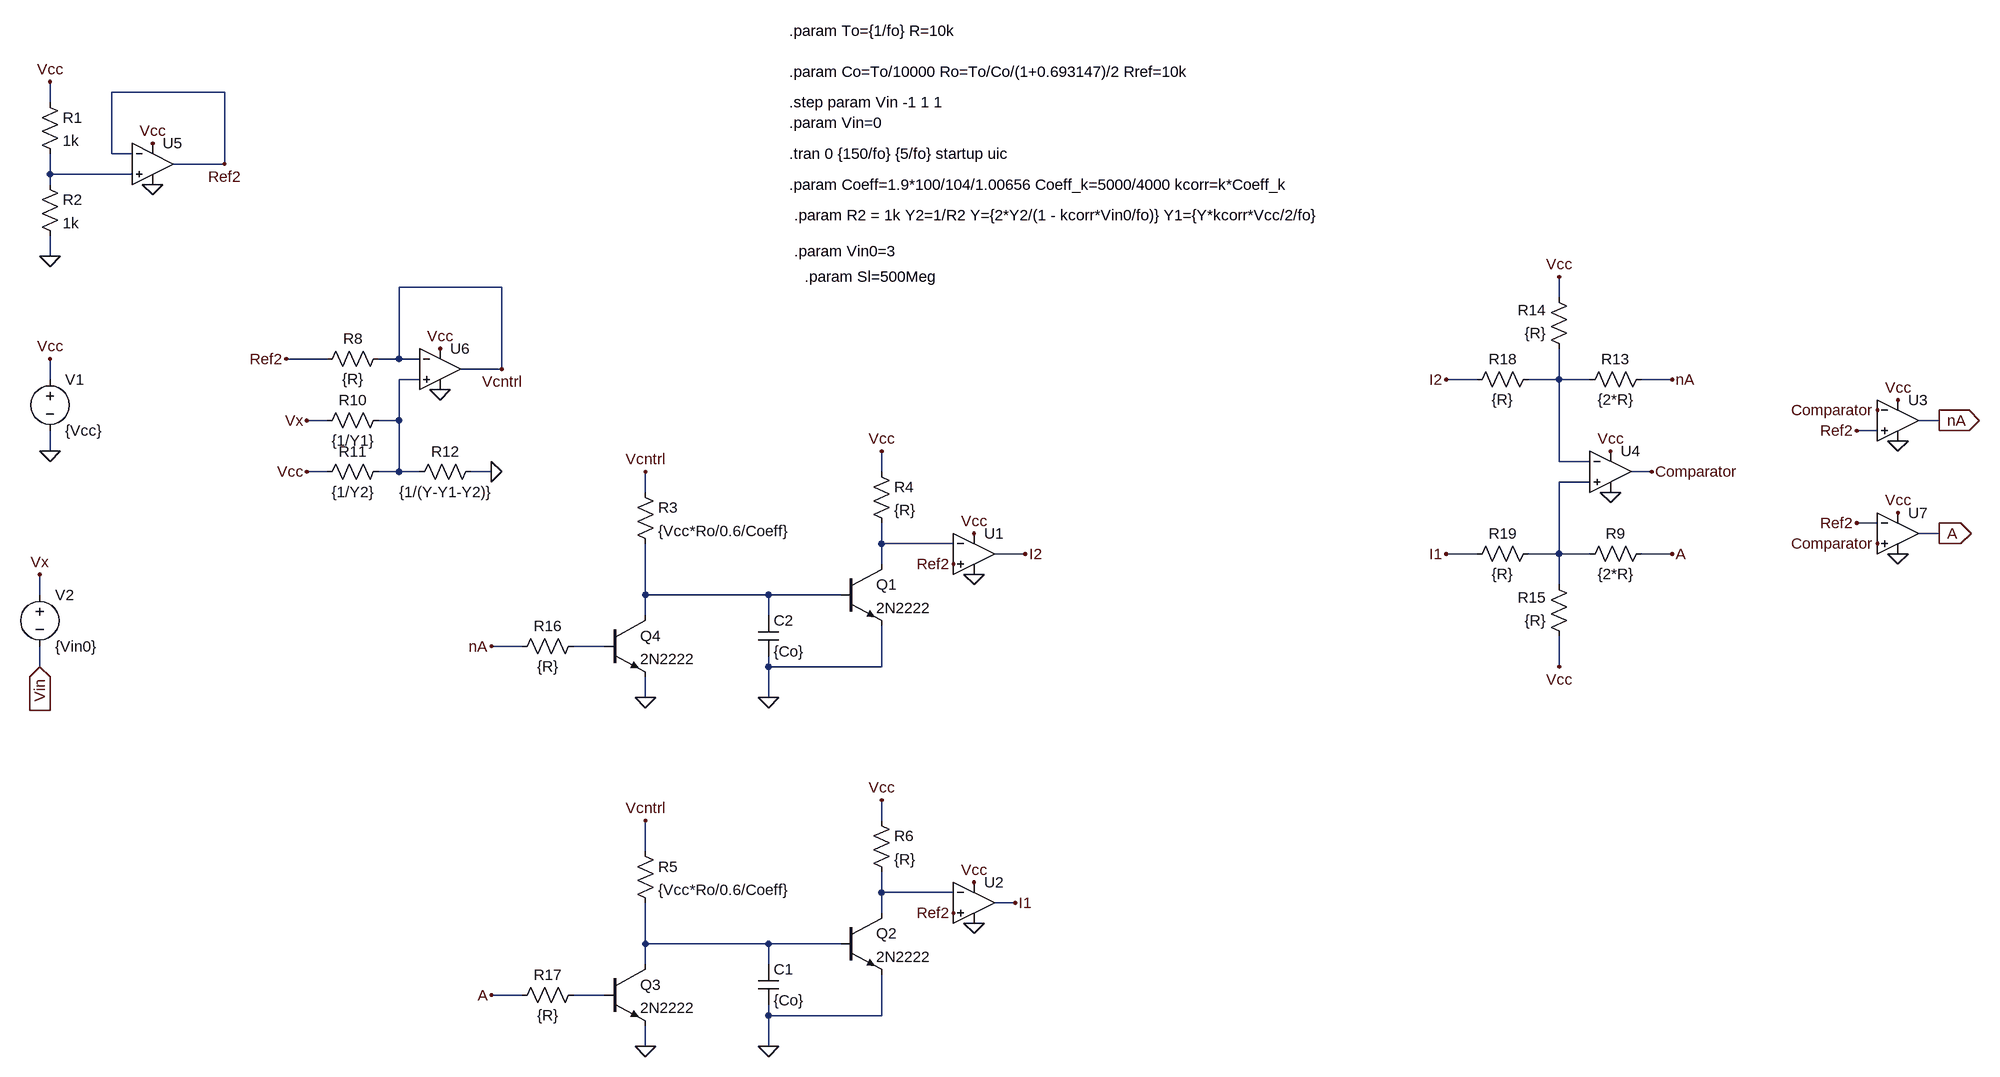
[diagram p0: schematic VCO_comp.asc]
VCO_comp.asc, the LTspice schematic file:
Version 4
SHEET 1 2680 1780
WIRE -80 -96 -256 -96
WIRE -352 -80 -352 -112
WIRE -256 0 -256 -96
WIRE -224 0 -256 0
WIRE -80 16 -80 -96
WIRE -80 16 -160 16
WIRE -352 32 -352 0
WIRE -224 32 -352 32
WIRE -352 48 -352 32
WIRE -352 160 -352 128
WIRE 352 208 192 208
WIRE 2000 224 2000 192
WIRE 80 320 16 320
WIRE 192 320 192 208
WIRE 192 320 160 320
WIRE 224 320 192 320
WIRE 352 336 352 208
WIRE 352 336 288 336
WIRE -352 352 -352 320
WIRE 224 352 192 352
WIRE 1872 352 1824 352
WIRE 2000 352 2000 304
WIRE 2000 352 1952 352
WIRE 2048 352 2000 352
WIRE 2176 352 2128 352
WIRE 80 416 48 416
WIRE 192 416 192 352
WIRE 192 416 160 416
WIRE 2592 416 2560 416
WIRE 2496 432 2464 432
WIRE -352 464 -352 432
WIRE 2000 480 2000 352
WIRE 2048 480 2000 480
WIRE 80 496 48 496
WIRE 192 496 192 416
WIRE 192 496 160 496
WIRE 224 496 192 496
WIRE 336 496 304 496
WIRE 944 496 944 464
WIRE 2144 496 2112 496
WIRE 2048 512 2000 512
WIRE 576 528 576 496
WIRE 2496 576 2464 576
WIRE 2592 592 2560 592
WIRE 944 608 944 576
WIRE 1056 608 944 608
WIRE 1168 624 1120 624
WIRE 1872 624 1824 624
WIRE 2000 624 2000 512
WIRE 2000 624 1952 624
WIRE 2048 624 2000 624
WIRE 2176 624 2128 624
WIRE 944 640 944 608
WIRE 2000 672 2000 624
WIRE -368 688 -368 656
WIRE 576 688 576 608
WIRE 768 688 576 688
WIRE 880 688 768 688
WIRE 576 720 576 688
WIRE 768 720 768 688
WIRE 384 768 336 768
WIRE 512 768 464 768
WIRE -368 800 -368 768
WIRE 768 800 768 784
WIRE 944 800 944 736
WIRE 944 800 768 800
WIRE 2000 800 2000 752
WIRE 576 848 576 816
WIRE 768 848 768 800
WIRE 944 1040 944 1008
WIRE 576 1088 576 1040
WIRE 944 1152 944 1120
WIRE 1056 1152 944 1152
WIRE 1152 1168 1120 1168
WIRE 944 1184 944 1152
WIRE 576 1232 576 1168
WIRE 768 1232 576 1232
WIRE 880 1232 768 1232
WIRE 576 1264 576 1232
WIRE 768 1264 768 1232
WIRE 384 1312 336 1312
WIRE 512 1312 464 1312
WIRE 768 1344 768 1328
WIRE 944 1344 944 1280
WIRE 944 1344 768 1344
WIRE 576 1392 576 1360
WIRE 768 1392 768 1344
FLAG -352 464 0
FLAG -352 320 Vcc
FLAG -352 160 0
FLAG -352 -112 Vcc
FLAG -80 16 Ref2
FLAG 2464 432 Ref2
FLAG 2080 464 Vcc
FLAG 2528 384 Vcc
FLAG 2080 528 0
FLAG 2528 448 0
FLAG 2592 592 A
IOPIN 2592 592 Out
FLAG 2592 416 nA
IOPIN 2592 416 Out
FLAG 2000 192 Vcc
FLAG 2000 800 Vcc
FLAG 1824 624 I1
FLAG 1824 352 I2
FLAG -368 656 Vx
FLAG -192 48 0
FLAG -192 -16 Vcc
FLAG 576 848 0
FLAG 768 848 0
FLAG 944 464 Vcc
FLAG 576 1392 0
FLAG 768 1392 0
FLAG 944 1008 Vcc
FLAG 1168 624 I2
FLAG 1152 1168 I1
FLAG 336 1312 A
FLAG 336 768 nA
FLAG 1088 656 0
FLAG 1088 592 Vcc
FLAG 1056 640 Ref2
FLAG 1088 1200 0
FLAG 1088 1136 Vcc
FLAG 1056 1184 Ref2
FLAG 16 320 Ref2
FLAG 256 304 Vcc
FLAG 256 368 0
FLAG 48 496 Vcc
FLAG 336 496 0
FLAG 48 416 Vx
FLAG 352 336 Vcntrl
FLAG 576 496 Vcntrl
FLAG 576 1040 Vcntrl
FLAG 2464 576 Ref2
FLAG 2528 560 Vcc
FLAG 2528 624 0
FLAG 2176 624 A
FLAG 2176 352 nA
FLAG 2144 496 Comparator
FLAG 2496 400 Comparator
FLAG 2496 608 Comparator
FLAG -368 800 Vin
IOPIN -368 800 In
SYMBOL voltage -352 336 R0
WINDOW 123 0 0 Left 0
WINDOW 39 0 0 Left 0
SYMATTR InstName V1
SYMATTR Value {Vcc}
SYMBOL res -368 -96 R0
SYMATTR InstName R1
SYMATTR Value 1k
SYMBOL res -368 32 R0
SYMATTR InstName R2
SYMATTR Value 1k
SYMBOL OpAmps\\UniversalOpAmp2 2528 416 R0
SYMATTR InstName U3
SYMATTR Value2 Avol=1Meg GBW=10Meg Slew={Sl}
SYMBOL OpAmps\\UniversalOpAmp2 2080 496 R0
SYMATTR InstName U4
SYMATTR Value2 Avol=1Meg GBW=10Meg Slew={Sl}
SYMBOL res 2144 608 R90
WINDOW 0 0 56 VBottom 2
WINDOW 3 32 56 VTop 2
SYMATTR InstName R9
SYMATTR Value {2*R}
SYMBOL res 2144 336 R90
WINDOW 0 0 56 VBottom 2
WINDOW 3 32 56 VTop 2
SYMATTR InstName R13
SYMATTR Value {2*R}
SYMBOL res 2016 320 R180
WINDOW 0 36 76 Left 2
WINDOW 3 36 40 Left 2
SYMATTR InstName R14
SYMATTR Value {R}
SYMBOL res 2016 768 R180
WINDOW 0 36 76 Left 2
WINDOW 3 36 40 Left 2
SYMATTR InstName R15
SYMATTR Value {R}
SYMBOL voltage -368 672 R0
WINDOW 123 0 0 Left 0
WINDOW 39 0 0 Left 0
SYMATTR InstName V2
SYMATTR Value {Vin0}
SYMBOL OpAmps\\UniversalOpAmp2 -192 16 R0
SYMATTR InstName U5
SYMBOL npn 880 640 R0
SYMATTR InstName Q1
SYMATTR Value 2N2222
SYMBOL res 560 512 R0
SYMATTR InstName R3
SYMATTR Value {Vcc*Ro/0.6/Coeff}
SYMBOL cap 752 720 R0
SYMATTR InstName C2
SYMATTR Value {Co}
SYMBOL res 928 480 R0
SYMATTR InstName R4
SYMATTR Value {R}
SYMBOL npn 880 1184 R0
SYMATTR InstName Q2
SYMATTR Value 2N2222
SYMBOL res 560 1072 R0
SYMATTR InstName R5
SYMATTR Value {Vcc*Ro/0.6/Coeff}
SYMBOL cap 752 1264 R0
SYMATTR InstName C1
SYMATTR Value {Co}
SYMBOL res 928 1024 R0
SYMATTR InstName R6
SYMATTR Value {R}
SYMBOL OpAmps\\UniversalOpAmp2 1088 624 R0
SYMATTR InstName U1
SYMATTR Value2 Avol=1Meg GBW=10Meg Slew={Sl}
SYMBOL OpAmps\\UniversalOpAmp2 1088 1168 R0
SYMATTR InstName U2
SYMATTR Value2 Avol=1Meg GBW=10Meg Slew={Sl}
SYMBOL OpAmps\\UniversalOpAmp2 256 336 R0
SYMATTR InstName U6
SYMBOL res 176 304 R90
WINDOW 0 0 56 VBottom 2
WINDOW 3 32 56 VTop 2
SYMATTR InstName R8
SYMATTR Value {R}
SYMBOL res 176 400 R90
WINDOW 0 0 56 VBottom 2
WINDOW 3 32 56 VTop 2
SYMATTR InstName R10
SYMATTR Value {1/Y1}
SYMBOL res 176 480 R90
WINDOW 0 0 56 VBottom 2
WINDOW 3 32 56 VTop 2
SYMATTR InstName R11
SYMATTR Value {1/Y2}
SYMBOL res 320 480 R90
WINDOW 0 0 56 VBottom 2
WINDOW 3 32 56 VTop 2
SYMATTR InstName R12
SYMATTR Value {1/(Y-Y1-Y2)}
SYMBOL npn 512 1264 R0
SYMATTR InstName Q3
SYMATTR Value 2N2222
SYMBOL npn 512 720 R0
SYMATTR InstName Q4
SYMATTR Value 2N2222
SYMBOL res 480 752 R90
WINDOW 0 0 56 VBottom 2
WINDOW 3 32 56 VTop 2
SYMATTR InstName R16
SYMATTR Value {R}
SYMBOL res 480 1296 R90
WINDOW 0 0 56 VBottom 2
WINDOW 3 32 56 VTop 2
SYMATTR InstName R17
SYMATTR Value {R}
SYMBOL res 1856 368 R270
WINDOW 0 32 56 VTop 2
WINDOW 3 0 56 VBottom 2
SYMATTR InstName R18
SYMATTR Value {R}
SYMBOL res 1856 640 R270
WINDOW 0 32 56 VTop 2
WINDOW 3 0 56 VBottom 2
SYMATTR InstName R19
SYMATTR Value {R}
SYMBOL OpAmps\\UniversalOpAmp2 2528 592 R0
SYMATTR InstName U7
SYMATTR Value2 Avol=1Meg GBW=10Meg Slew={Sl}
TEXT 800 0 Left 2 !.tran 0 {150/fo} {5/fo} startup uic
TEXT 800 -128 Left 2 !.param Co=To/10000 Ro=To/Co/(1+0.693147)/2 Rref=10k
TEXT 800 -80 Left 2 !.step param Vin -1 1 1
TEXT 800 -48 Left 2 !.param Vin=0
TEXT 800 -192 Left 2 !.param To={1/fo} R=10k
TEXT 800 48 Left 2 !.param Coeff=1.9*100/104/1.00656 Coeff_k=5000/4000 kcorr=k*Coeff_k
TEXT 808 96 Left 2 !.param R2 = 1k Y2=1/R2 Y={2*Y2/(1 - kcorr*Vin0/fo)} Y1={Y*kcorr*Vcc/2/fo}
TEXT 808 152 Left 2 !.param Vin0=3
TEXT 824 192 Left 2 !.param Sl=500Meg

The netlist it stands for:
* VCO_comp.asc
V1 Vcc 0 {Vcc}
R1 Vcc N001 1k
R2 N001 0 1k
XU3 Ref2 Comparator Vcc 0 nA level2 Avol=1Meg GBW=10Meg Slew={Sl} Ilimit=25m Rail=0 Vos=0 En=0 Enk=0 In=0 Ink=0 Rin=500Meg  ; pins In+ In- V+ V- OUT
XU4 N004 N003 Vcc 0 Comparator level2 Avol=1Meg GBW=10Meg Slew={Sl} Ilimit=25m Rail=0 Vos=0 En=0 Enk=0 In=0 Ink=0 Rin=500Meg  ; pins In+ In- V+ V- OUT
R9 A N004 {2*R}
R13 nA N003 {2*R}
R14 N003 Vcc {R}
R15 Vcc N004 {R}
V2 Vx Vin {Vin0}
XU5 N001 Ref2 Vcc 0 Ref2 level2 Avol=1Meg GBW=10Meg Slew=10Meg Ilimit=25m Rail=0 Vos=0 En=0 Enk=0 In=0 Ink=0 Rin=500Meg  ; pins In+ In- V+ V- OUT
Q1 N005 N006 0 0 2N2222
R3 Vcntrl N006 {Vcc*Ro/0.6/Coeff}
C2 N006 0 {Co}
R4 Vcc N005 {R}
Q2 N008 N009 0 0 2N2222
R5 Vcntrl N009 {Vcc*Ro/0.6/Coeff}
C1 N009 0 {Co}
R6 Vcc N008 {R}
XU1 Ref2 N005 Vcc 0 I2 level2 Avol=1Meg GBW=10Meg Slew={Sl} Ilimit=25m Rail=0 Vos=0 En=0 Enk=0 In=0 Ink=0 Rin=500Meg  ; pins In+ In- V+ V- OUT
XU2 Ref2 N008 Vcc 0 I1 level2 Avol=1Meg GBW=10Meg Slew={Sl} Ilimit=25m Rail=0 Vos=0 En=0 Enk=0 In=0 Ink=0 Rin=500Meg  ; pins In+ In- V+ V- OUT
XU6 N002 Vcntrl Vcc 0 Vcntrl level2 Avol=1Meg GBW=10Meg Slew=10Meg Ilimit=25m Rail=0 Vos=0 En=0 Enk=0 In=0 Ink=0 Rin=500Meg  ; pins In+ In- V+ V- OUT
R8 Vcntrl Ref2 {R}
R10 N002 Vx {1/Y1}
R11 N002 Vcc {1/Y2}
R12 0 N002 {1/(Y-Y1-Y2)}
Q3 N009 N010 0 0 2N2222
Q4 N006 N007 0 0 2N2222
R16 N007 nA {R}
R17 N010 A {R}
R18 I2 N003 {R}
R19 I1 N004 {R}
XU7 Comparator Ref2 Vcc 0 A level2 Avol=1Meg GBW=10Meg Slew={Sl} Ilimit=25m Rail=0 Vos=0 En=0 Enk=0 In=0 Ink=0 Rin=500Meg  ; pins In+ In- V+ V- OUT
.model NPN NPN
.model PNP PNP
.lib standard.bjt
.tran 0 {150/fo} {5/fo} startup uic
.param Co=To/10000 Ro=To/Co/(1+0.693147)/2 Rref=10k
.step param Vin -1 1 1
.param Vin=0
.param To={1/fo} R=10k
.param Coeff=1.9*100/104/1.00656 Coeff_k=5000/4000 kcorr=k*Coeff_k
.param R2 = 1k Y2=1/R2 Y={2*Y2/(1 - kcorr*Vin0/fo)} Y1={Y*kcorr*Vcc/2/fo}
.param Vin0=3
.param Sl=500Meg
.lib UniversalOpAmp2.lib
.backanno
.end